# EAGLE schematic axiom_beta_plugin_module_3xPMOD_v1.1 (EAGLE 7.0.0)
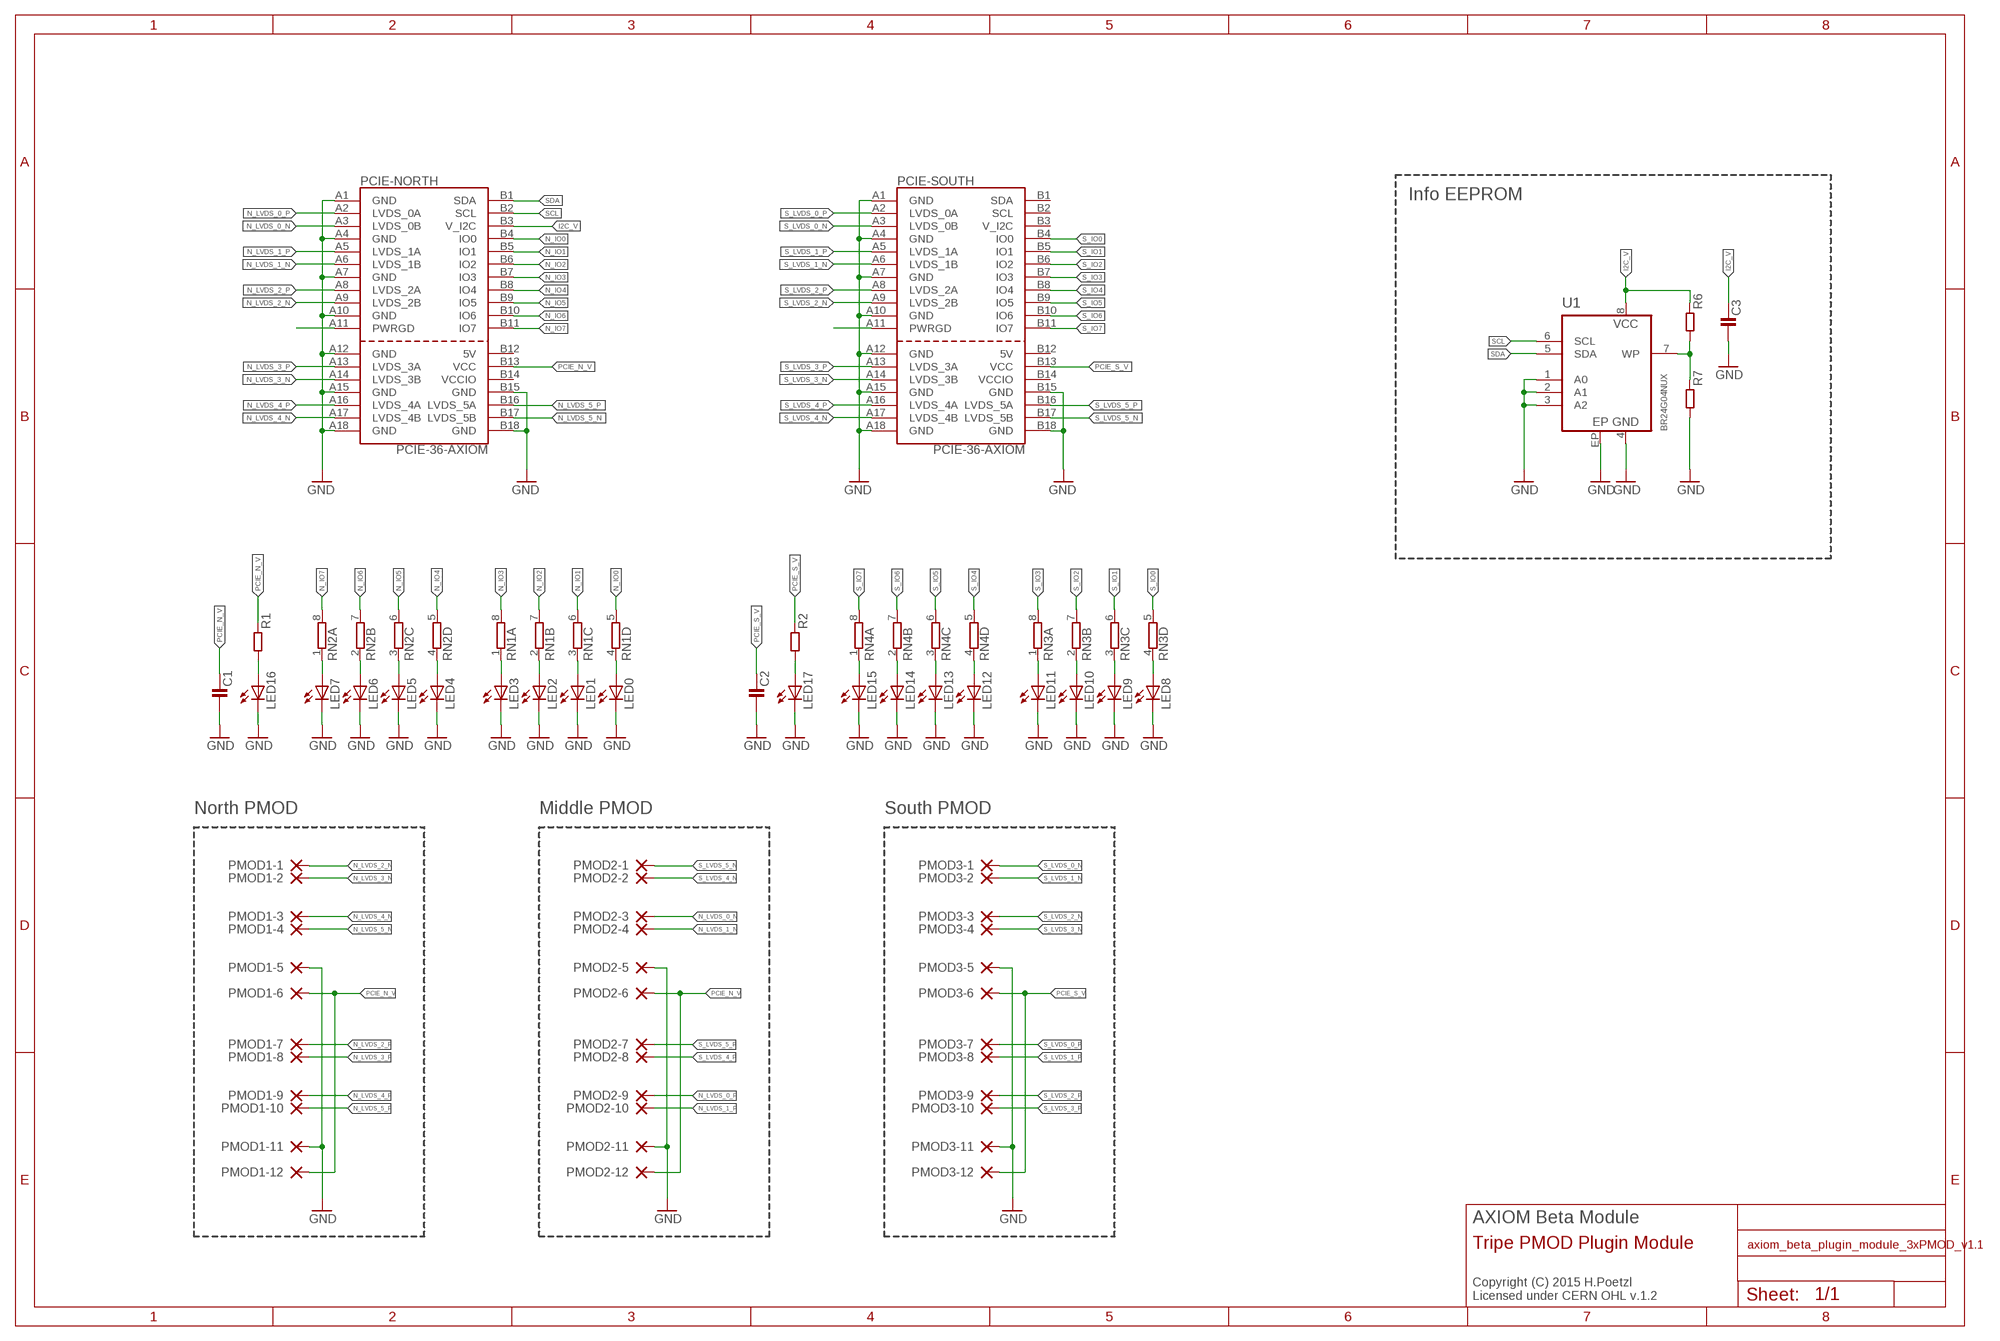
[diagram p0: schematic, sheet 1]

## Parts
C1  C1206-A  [1206-A]
C2  C1206-A  [1206-A]
C3  C0402-B  [0402-B]
LED0  LEDCHIPLED_0603  [CHIPLED_0603]
LED1  LEDCHIPLED_0603  [CHIPLED_0603]
LED2  LEDCHIPLED_0603  [CHIPLED_0603]
LED3  LEDCHIPLED_0603  [CHIPLED_0603]
LED4  LEDCHIPLED_0603  [CHIPLED_0603]
LED5  LEDCHIPLED_0603  [CHIPLED_0603]
LED6  LEDCHIPLED_0603  [CHIPLED_0603]
LED7  LEDCHIPLED_0603  [CHIPLED_0603]
LED8  LEDCHIPLED_0603  [CHIPLED_0603]
LED9  LEDCHIPLED_0603  [CHIPLED_0603]
LED10  LEDCHIPLED_0603  [CHIPLED_0603]
LED11  LEDCHIPLED_0603  [CHIPLED_0603]
LED12  LEDCHIPLED_0603  [CHIPLED_0603]
LED13  LEDCHIPLED_0603  [CHIPLED_0603]
LED14  LEDCHIPLED_0603  [CHIPLED_0603]
LED15  LEDCHIPLED_0603  [CHIPLED_0603]
LED16  LEDCHIPLED_0603  [CHIPLED_0603]
LED17  LEDCHIPLED_0603  [CHIPLED_0603]
PCIE-NORTH  PCIE-36-AXIOM  [PCIE-36-AXIOM]
PCIE-SOUTH  PCIE-36-AXIOM  [PCIE-36-AXIOM]
PMOD1-1  SMD-PAD1.6X3.8MM-U  [1.6X3.8U-MM]
PMOD1-2  SMD-PAD1.6X3.8MM-U  [1.6X3.8U-MM]
PMOD1-3  SMD-PAD1.6X3.8MM-U  [1.6X3.8U-MM]
PMOD1-4  SMD-PAD1.6X3.8MM-U  [1.6X3.8U-MM]
PMOD1-5  SMD-PAD1.6X3.8MM-U  [1.6X3.8U-MM]
PMOD1-6  SMD-PAD1.6X3.8MM-U  [1.6X3.8U-MM]
PMOD1-7  SMD-PAD1.6X3.8MM-U  [1.6X3.8U-MM]
PMOD1-8  SMD-PAD1.6X3.8MM-U  [1.6X3.8U-MM]
PMOD1-9  SMD-PAD1.6X3.8MM-U  [1.6X3.8U-MM]
PMOD1-10  SMD-PAD1.6X3.8MM-U  [1.6X3.8U-MM]
PMOD1-11  SMD-PAD1.6X3.8MM-U  [1.6X3.8U-MM]
PMOD1-12  SMD-PAD1.6X3.8MM-U  [1.6X3.8U-MM]
PMOD2-1  SMD-PAD1.6X3.8MM-U  [1.6X3.8U-MM]
PMOD2-2  SMD-PAD1.6X3.8MM-U  [1.6X3.8U-MM]
PMOD2-3  SMD-PAD1.6X3.8MM-U  [1.6X3.8U-MM]
PMOD2-4  SMD-PAD1.6X3.8MM-U  [1.6X3.8U-MM]
PMOD2-5  SMD-PAD1.6X3.8MM-U  [1.6X3.8U-MM]
PMOD2-6  SMD-PAD1.6X3.8MM-U  [1.6X3.8U-MM]
PMOD2-7  SMD-PAD1.6X3.8MM-U  [1.6X3.8U-MM]
PMOD2-8  SMD-PAD1.6X3.8MM-U  [1.6X3.8U-MM]
PMOD2-9  SMD-PAD1.6X3.8MM-U  [1.6X3.8U-MM]
PMOD2-10  SMD-PAD1.6X3.8MM-U  [1.6X3.8U-MM]
PMOD2-11  SMD-PAD1.6X3.8MM-U  [1.6X3.8U-MM]
PMOD2-12  SMD-PAD1.6X3.8MM-U  [1.6X3.8U-MM]
PMOD3-1  SMD-PAD1.6X3.8MM-U  [1.6X3.8U-MM]
PMOD3-2  SMD-PAD1.6X3.8MM-U  [1.6X3.8U-MM]
PMOD3-3  SMD-PAD1.6X3.8MM-U  [1.6X3.8U-MM]
PMOD3-4  SMD-PAD1.6X3.8MM-U  [1.6X3.8U-MM]
PMOD3-5  SMD-PAD1.6X3.8MM-U  [1.6X3.8U-MM]
PMOD3-6  SMD-PAD1.6X3.8MM-U  [1.6X3.8U-MM]
PMOD3-7  SMD-PAD1.6X3.8MM-U  [1.6X3.8U-MM]
PMOD3-8  SMD-PAD1.6X3.8MM-U  [1.6X3.8U-MM]
PMOD3-9  SMD-PAD1.6X3.8MM-U  [1.6X3.8U-MM]
PMOD3-10  SMD-PAD1.6X3.8MM-U  [1.6X3.8U-MM]
PMOD3-11  SMD-PAD1.6X3.8MM-U  [1.6X3.8U-MM]
PMOD3-12  SMD-PAD1.6X3.8MM-U  [1.6X3.8U-MM]
R1  R0402-B  [0402-B]
R2  R0402-B  [0402-B]
R6  R0402-B  [0402-B]
R7  R0402-B  [0402-B]
RN1  4R-NCAY16  [CAY16]
RN2  4R-NCAY16  [CAY16]
RN3  4R-NCAY16  [CAY16]
RN4  4R-NCAY16  [CAY16]
U1  BR24G04NUX  [DFN200X300X100-9N]

## Nets
GND: C1.2 C2.2 C3.2 LED0.C LED1.C LED2.C LED3.C LED4.C LED5.C LED6.C LED7.C LED8.C LED9.C LED10.C LED11.C LED12.C LED13.C LED14.C LED15.C LED16.C LED17.C PCIE-NORTH.A1(GND) PCIE-NORTH.A4(GND) PCIE-NORTH.A7(GND) PCIE-NORTH.A10(GND) PCIE-NORTH.A12(GND) PCIE-NORTH.A15(GND) PCIE-NORTH.A18(GND) PCIE-NORTH.B15(GND) PCIE-NORTH.B18(GND) PCIE-SOUTH.A1(GND) PCIE-SOUTH.A4(GND) PCIE-SOUTH.A7(GND) PCIE-SOUTH.A10(GND) PCIE-SOUTH.A12(GND) PCIE-SOUTH.A15(GND) PCIE-SOUTH.A18(GND) PCIE-SOUTH.B15(GND) PCIE-SOUTH.B18(GND) PMOD1-5.1(P) PMOD1-11.1(P) PMOD2-5.1(P) PMOD2-11.1(P) PMOD3-5.1(P) PMOD3-11.1(P) R7.2 U1.1(A0) U1.2(A1) U1.3(A2) U1.4(GND) U1.EP
I2C_V: C3.1 PCIE-NORTH.B3(V_I2C) R6.1 U1.8(VCC)
N$196: LED3.A RN1.1
N$197: LED2.A RN1.2
N$198: LED1.A RN1.3
N$202: LED0.A RN1.4
N$209: PCIE-NORTH.A11(PWRGD)
N$211: LED16.A R1.2
N$214: LED17.A R2.2
N$216: R6.2 R7.1 U1.7(WP)
N$256: PCIE-SOUTH.A11(PWRGD)
N$275: LED7.A RN2.1
N$276: LED6.A RN2.2
N$277: LED5.A RN2.3
N$278: LED4.A RN2.4
N$322: LED11.A RN3.1
N$323: LED10.A RN3.2
N$324: LED9.A RN3.3
N$325: LED8.A RN3.4
N$369: LED15.A RN4.1
N$370: LED14.A RN4.2
N$371: LED13.A RN4.3
N$372: LED12.A RN4.4
N_IO0: PCIE-NORTH.B4(IO0) RN1.5
N_IO1: PCIE-NORTH.B5(IO1) RN1.6
N_IO2: PCIE-NORTH.B6(IO2) RN1.7
N_IO3: PCIE-NORTH.B7(IO3) RN1.8
N_IO4: PCIE-NORTH.B8(IO4) RN2.5
N_IO5: PCIE-NORTH.B9(IO5) RN2.6
N_IO6: PCIE-NORTH.B10(IO6) RN2.7
N_IO7: PCIE-NORTH.B11(IO7) RN2.8
N_LVDS_0_N: PCIE-NORTH.A3(LVDS_0B) PMOD2-3.1(P)
N_LVDS_0_P: PCIE-NORTH.A2(LVDS_0A) PMOD2-9.1(P)
N_LVDS_1_N [LVDS]: PCIE-NORTH.A6(LVDS_1B) PMOD2-4.1(P)
N_LVDS_1_P [LVDS]: PCIE-NORTH.A5(LVDS_1A) PMOD2-10.1(P)
N_LVDS_2_N [LVDS]: PCIE-NORTH.A9(LVDS_2B) PMOD1-1.1(P)
N_LVDS_2_P [LVDS]: PCIE-NORTH.A8(LVDS_2A) PMOD1-7.1(P)
N_LVDS_3_N: PCIE-NORTH.A14(LVDS_3B) PMOD1-2.1(P)
N_LVDS_3_P: PCIE-NORTH.A13(LVDS_3A) PMOD1-8.1(P)
N_LVDS_4_N [LVDS]: PCIE-NORTH.A17(LVDS_4B) PMOD1-3.1(P)
N_LVDS_4_P [LVDS]: PCIE-NORTH.A16(LVDS_4A) PMOD1-9.1(P)
N_LVDS_5_N [LVDS]: PCIE-NORTH.B17(LVDS_5B) PMOD1-4.1(P)
N_LVDS_5_P [LVDS]: PCIE-NORTH.B16(LVDS_5A) PMOD1-10.1(P)
PCIE_N_V: C1.1 PCIE-NORTH.B13(VCC) PMOD1-6.1(P) PMOD1-12.1(P) PMOD2-6.1(P) PMOD2-12.1(P) R1.1
PCIE_S_V: C2.1 PCIE-SOUTH.B13(VCC) PMOD3-6.1(P) PMOD3-12.1(P) R2.1
S_IO0: PCIE-SOUTH.B4(IO0) RN3.5
S_IO1: PCIE-SOUTH.B5(IO1) RN3.6
S_IO2: PCIE-SOUTH.B6(IO2) RN3.7
S_IO3: PCIE-SOUTH.B7(IO3) RN3.8
S_IO4: PCIE-SOUTH.B8(IO4) RN4.5
S_IO5: PCIE-SOUTH.B9(IO5) RN4.6
S_IO6: PCIE-SOUTH.B10(IO6) RN4.7
S_IO7: PCIE-SOUTH.B11(IO7) RN4.8
S_LVDS_0_N [LVDS]: PCIE-SOUTH.A3(LVDS_0B) PMOD3-1.1(P)
S_LVDS_0_P [LVDS]: PCIE-SOUTH.A2(LVDS_0A) PMOD3-7.1(P)
S_LVDS_1_N: PCIE-SOUTH.A6(LVDS_1B) PMOD3-2.1(P)
S_LVDS_1_P: PCIE-SOUTH.A5(LVDS_1A) PMOD3-8.1(P)
S_LVDS_2_N [LVDS]: PCIE-SOUTH.A9(LVDS_2B) PMOD3-3.1(P)
S_LVDS_2_P [LVDS]: PCIE-SOUTH.A8(LVDS_2A) PMOD3-9.1(P)
S_LVDS_3_N [LVDS]: PCIE-SOUTH.A14(LVDS_3B) PMOD3-4.1(P)
S_LVDS_3_P [LVDS]: PCIE-SOUTH.A13(LVDS_3A) PMOD3-10.1(P)
S_LVDS_4_N [LVDS]: PCIE-SOUTH.A17(LVDS_4B) PMOD2-2.1(P)
S_LVDS_4_P [LVDS]: PCIE-SOUTH.A16(LVDS_4A) PMOD2-8.1(P)
S_LVDS_5_N [LVDS]: PCIE-SOUTH.B17(LVDS_5B) PMOD2-1.1(P)
S_LVDS_5_P [LVDS]: PCIE-SOUTH.B16(LVDS_5A) PMOD2-7.1(P)
SCL: PCIE-NORTH.B2(SCL) U1.6(SCL)
SDA: PCIE-NORTH.B1(SDA) U1.5(SDA)
Unconnected: PCIE-NORTH.B12(5V) PCIE-NORTH.B14(VCCIO) PCIE-SOUTH.B1(SDA) PCIE-SOUTH.B2(SCL) PCIE-SOUTH.B3(V_I2C) PCIE-SOUTH.B12(5V) PCIE-SOUTH.B14(VCCIO)

## Notes on the sheet
- Info EEPROM
- North PMOD | Middle PMOD | South PMOD
- AXIOM Beta Module
- Tripe PMOD Plugin Module
- Copyright (C) 2015 H.Poetzl
  Licensed under CERN OHL v.1.2

## Library data of the parts
C1-C3 = generic-rcl:C
LED0 LED1-LED17 = led:LED: LED OSRAM: - CHIPLED LG R971, LG N971, LY N971, LG Q971, LY Q971, LO R971, LY R971 LH N974, LH R974 LS Q976, LO Q976, LY Q976 LO Q996 - Hyper CHIPLED LW Q18S LB Q993, LB Q99A, LB R99A - SideLED LS A670, LO A670, LY A670, LG A670, LP A670 LB A673, LV A673, LT A673, LW A673 LH A674 LY A675 LS A676, LA A676, LO A676, LY A676, LW A676 LS A679, LY A679, LG A679 - Hyper Micro SIDELED® LS Y876, LA Y876, LO Y876, LY Y876 LT Y87S - SmartLED LW L88C, LW L88S LB L89C, LB L89S, LG L890 LS L89K, LO L89K, LY L89K LS L896, LA L896, LO L896, LY L896 - TOPLED LS T670, LO T670, LY T670, LG T670, LP T670 LSG T670, LSP T670, LSY T670, LOP T670, LYG T670 LG T671, LOG T671, LSG T671 LB T673, LV T673, LT T673, LW T673 LH T674 LS T676, LA T676, LO T676, LY T676, LB T676, LH T676, LSB T676, LW T676 LB T67C, LV T67C, LT T67C, LS T67K, LO T67K, LY T67K, LW E67C LS E67B, LA E67B, LO E67B, LY E67B, LB E67C, LV E67C, LT E67C LW T67C LS T679, LY T679, LG T679 LS T770, LO T770, LY T770, LG T770, LP T770 LB T773, LV T773, LT T773, LW T773 LH T774 LS E675, LA E675, LY E675, LS T675 LS T776, LA T776, LO T776, LY T776, LB T776 LHGB T686 LT T68C, LB T68C - Hyper Mini TOPLED® LB M676 - Mini TOPLED Santana® LG M470 LS M47K, LO M47K, LY M47K Source: http://www.osram.convergy.de LUXEON: - LUMILED® LXK2-PW12-R00, LXK2-PW12-S00, LXK2-PW14-U00, LXK2-PW14-V00 LXK2-PM12-R00, LXK2-PM12-S00, LXK2-PM14-U00 LXK2-PE12-Q00, LXK2-PE12-R00, LXK2-PE12-S00, LXK2-PE14-T00, LXK2-PE14-U00 LXK2-PB12-K00, LXK2-PB12-L00, LXK2-PB12-M00, LXK2-PB14-N00, LXK2-PB14-P00, LXK2-PB14-Q00 LXK2-PR12-L00, LXK2-PR12-M00, LXK2-PR14-Q00, LXK2-PR14-R00 LXK2-PD12-Q00, LXK2-PD12-R00, LXK2-PD12-S00 LXK2-PH12-R00, LXK2-PH12-S00 LXK2-PL12-P00, LXK2-PL12-Q00, LXK2-PL12-R00 Source: www.luxeon.com KINGBRIGHT: KA-3528ASYC Source: www.kingbright.com
PCIE-NORTH PCIE-SOUTH = PCIe:PCIE-36-AXIOM
PMOD1-1-PMOD1-12 PMOD2-1-PMOD2-12 PMOD3-1-PMOD3-12 = smd_pads:SMD-PAD: SMD PAD
R1 R2 R6 R7 = generic-rcl:R
RN1-RN4 = resistor-dil:4R-N: Array Chip Resistor Source: RS Component / Phycomp; OC_FARNELL: unknown; OC_NEWARK: unknown
U1 = eeprom:BR24G04

## Net classes
0 default: width 0.152 mm, drill 0.254 mm, clearance 0.152 mm
1 LVDS: width 0.152 mm, drill 0.254 mm, clearance 0.152 mm